# EAGLE design PoE_MotorDriver-REVA (EAGLE 8.4.2)
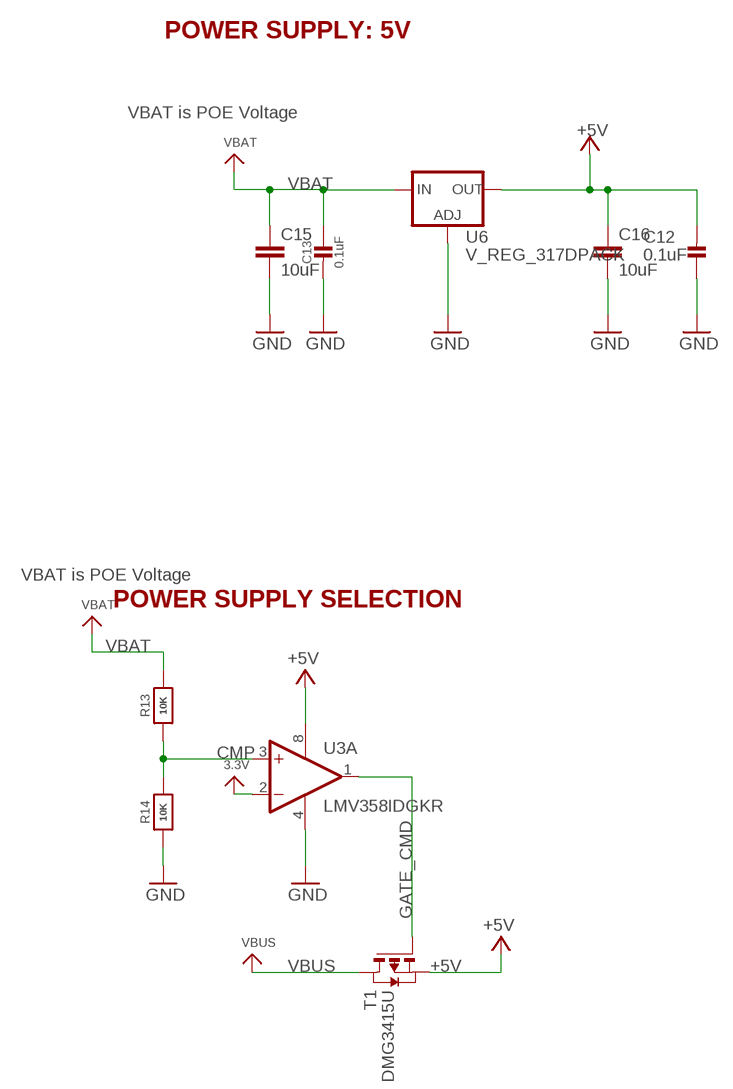
[diagram p0: schematic, sheet 1, part 1 of 2]
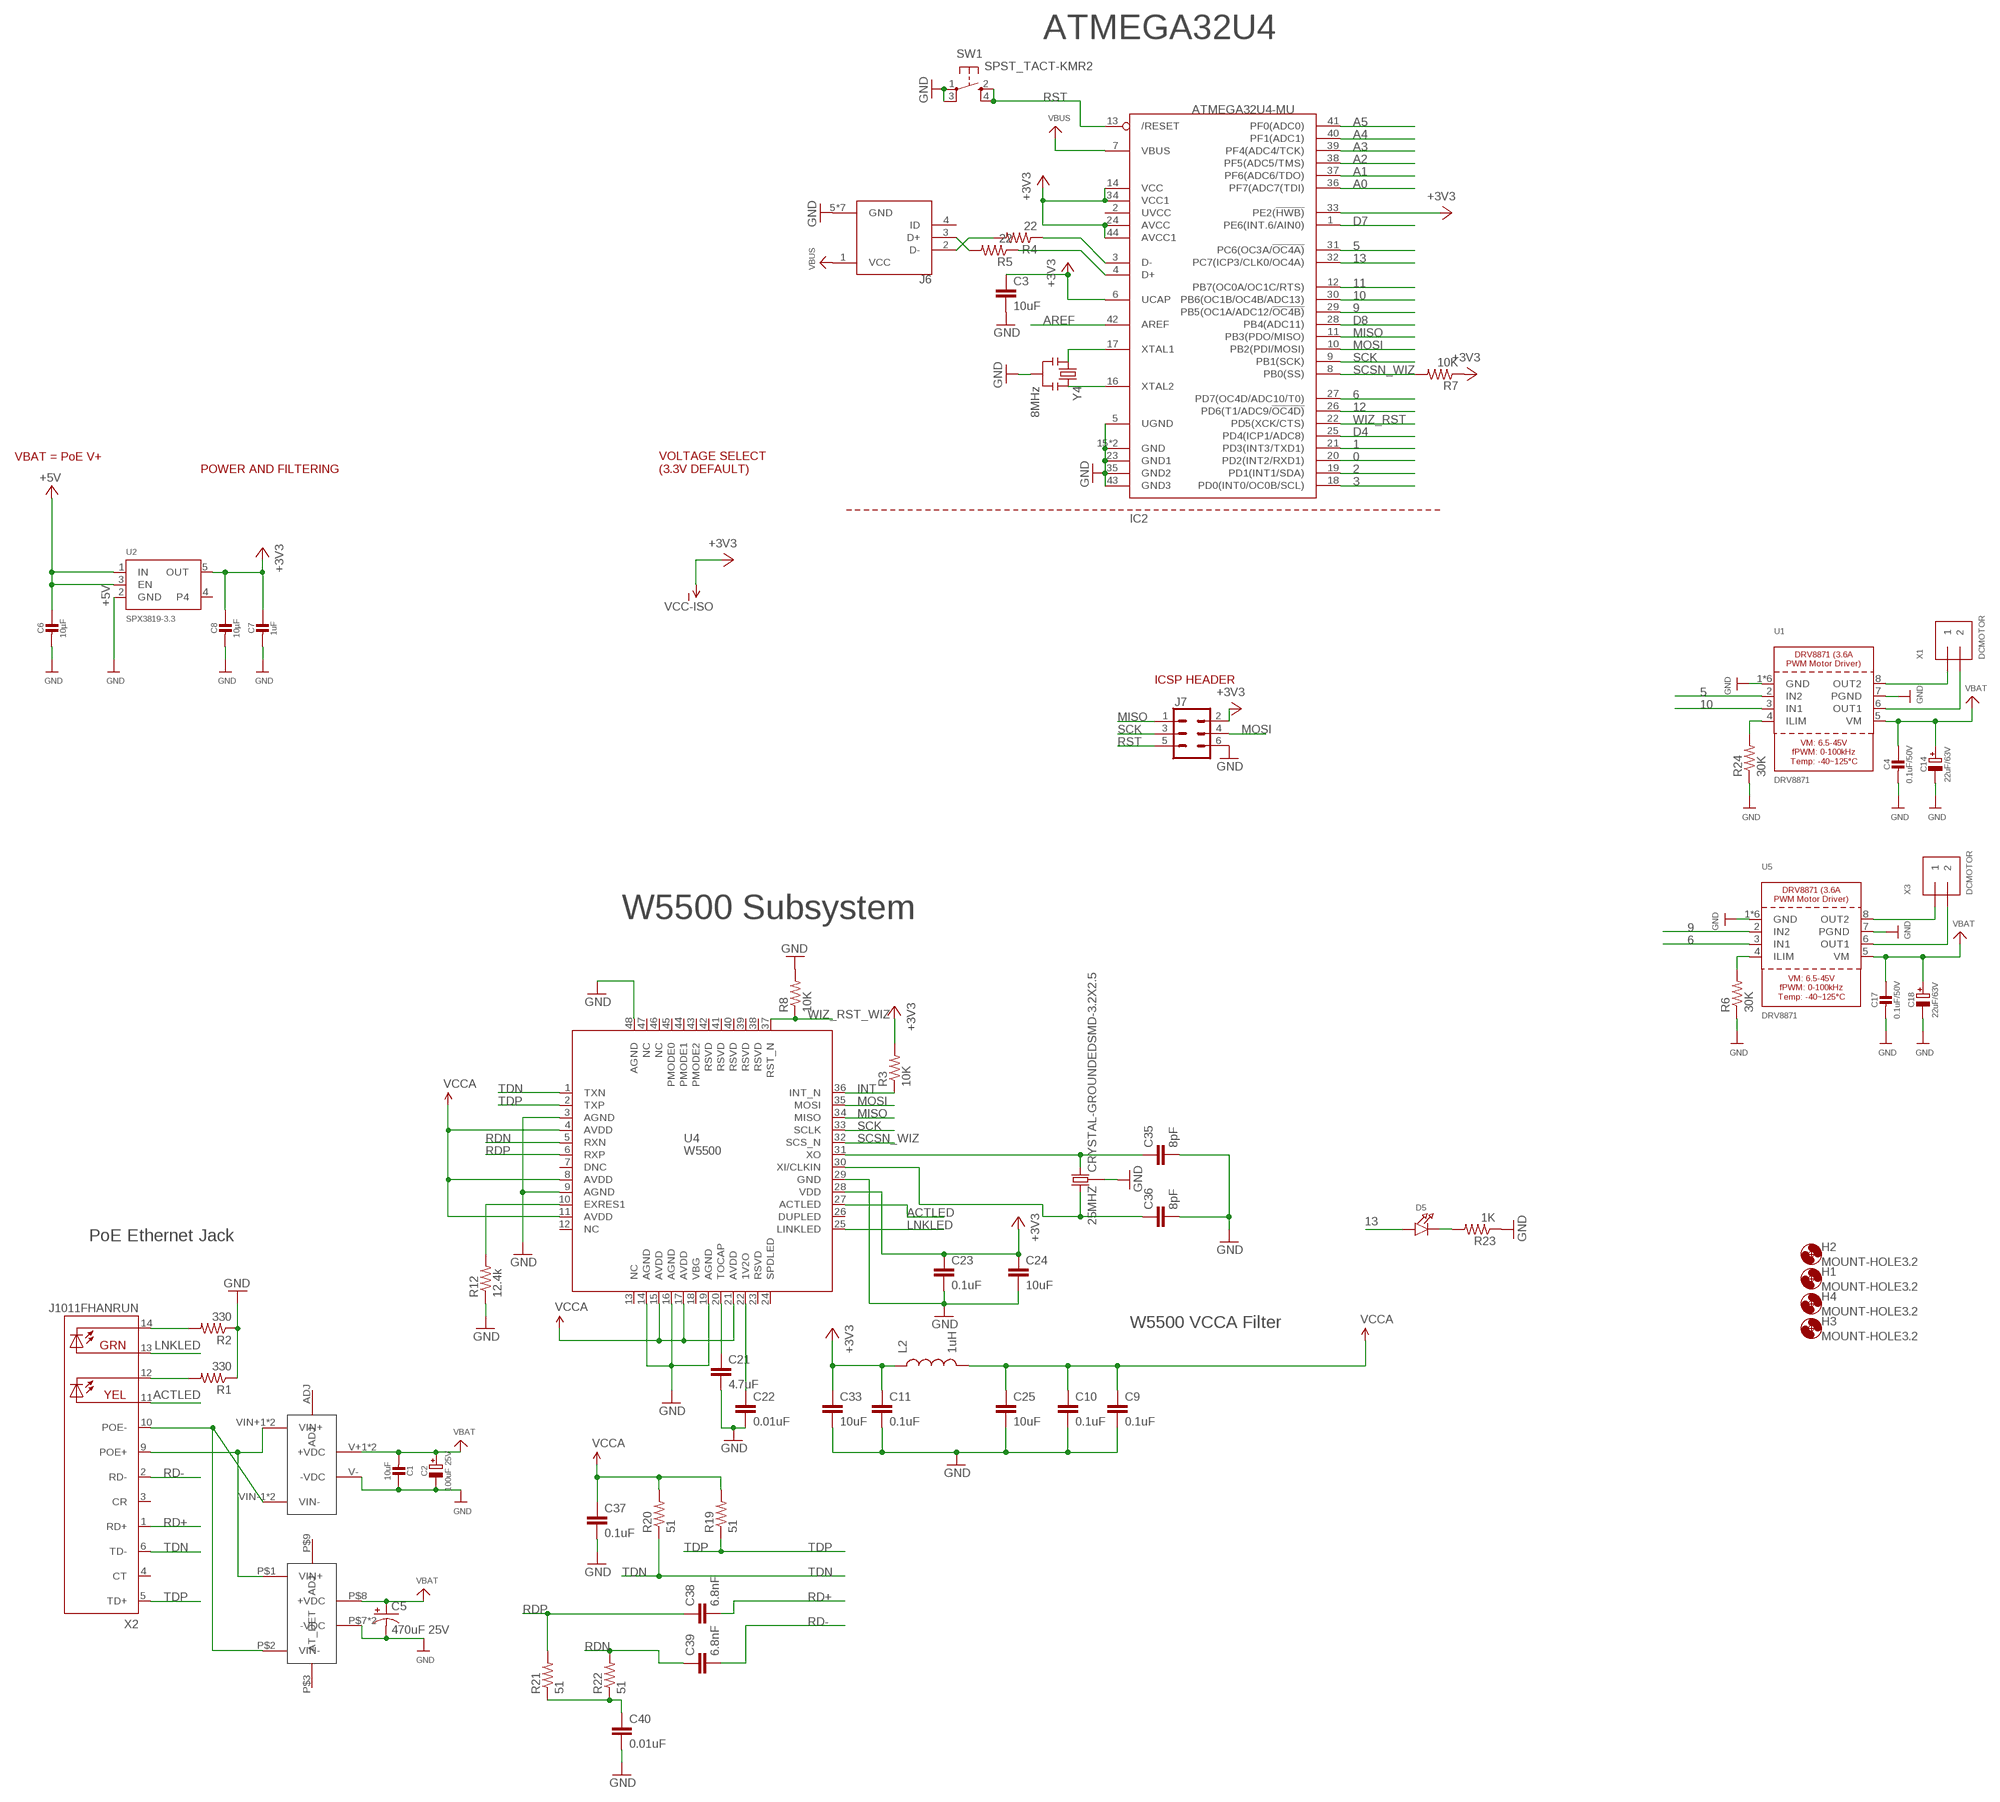
[diagram p1: schematic, sheet 1, part 2 of 2]

## Parts
25MHZ  CRYSTAL-GROUNDEDSMD-3.2X2.5  [CRYSTAL-SMD-3.2X2.5MM]
C1  10uF  CAP_CERAMIC_0805MP  [_0805MP]
C2  100uF 25V  CAP_ELECTROLYTICPANASONIC_D  [PANASONIC_D]
C3  10uF  CAP0603-CAP  [0603-CAP]
C4  0.1uF/50V  CAP_CERAMIC0603_NO  [0603-NO]
C5  470uF 25V  CAP_POLG  [PANASONIC_G]
C6  10µF  CAP_CERAMIC0603MINI  [0603-MINI]
C7  1uF  CAP_CERAMIC0603MINI  [0603-MINI]
C8  10µF  CAP_CERAMIC0603MINI  [0603-MINI]
C9  0.1uF  CAP0603-CAP  [0603-CAP]
C10  0.1uF  CAP0603-CAP  [0603-CAP]
C11  0.1uF  CAP0603-CAP  [0603-CAP]
C12  0.1uF  CAP_CERAMIC0603_NO  [0603-NO]
C13  0.1uF  CAP_CERAMIC0603_NO  [0603-NO]
C14  22uF/63V  CAP_ELECTROLYTICPANASONIC_D  [PANASONIC_D]
C15  10uF  CAP0603-CAP  [0603-CAP]
C16  10uF  CAP0603-CAP  [0603-CAP]
C17  0.1uF/50V  CAP_CERAMIC0603_NO  [0603-NO]
C18  22uF/63V  CAP_ELECTROLYTICPANASONIC_D  [PANASONIC_D]
C21  4.7uF  CAP0603-CAP  [0603-CAP]
C22  0.01uF  CAP0603-CAP  [0603-CAP]
C23  0.1uF  CAP0603-CAP  [0603-CAP]
C24  10uF  CAP0603-CAP  [0603-CAP]
C25  10uF  CAP0603-CAP  [0603-CAP]
C33  10uF  CAP0603-CAP  [0603-CAP]
C35  8pF  CAP0603-CAP  [0603-CAP]
C36  8pF  CAP0603-CAP  [0603-CAP]
C37  0.1uF  CAP0603-CAP  [0603-CAP]
C38  6.8nF  CAP0603-CAP  [0603-CAP]
C39  6.8nF  CAP0603-CAP  [0603-CAP]
C40  0.01uF  CAP0603-CAP  [0603-CAP]
D5  LED0805_NOOUTLINE  [CHIPLED_0805_NOOUTLINE]
H1  MOUNT-HOLE3.2  [3,2]
H2  MOUNT-HOLE3.2  [3,2]
H3  MOUNT-HOLE3.2  [3,2]
H4  MOUNT-HOLE3.2  [3,2]
IC2  ATMEGA32U4-MU  [TQFN44_7MM]
J6  10103594-0001LF  [FCI_10103594-0001LF]
J7  CONN_03X2NO_SILK  [2X3-NS]
L2  1uH  INDUCTOR0603  [0603]
R1  330  RESISTOR0603-RES  [0603-RES]
R2  330  RESISTOR0603-RES  [0603-RES]
R3  10K  RESISTOR0603-RES  [0603-RES]
R4  22  RESISTOR0603-RES  [0603-RES]
R5  22  RESISTOR0603-RES  [0603-RES]
R6  30K  FLIPFLOP-RES  [0805-THM]
R7  10K  RESISTOR0603-RES  [0603-RES]
R8  10K  RESISTOR0603-RES  [0603-RES]
R12  12.4k  RESISTOR0603-RES  [0603-RES]
R13  10K  RESISTOR_0603_NOOUT  [0603-NO]
R14  10K  RESISTOR_0603_NOOUT  [0603-NO]
R19  51  RESISTOR0603-RES  [0603-RES]
R20  51  RESISTOR0603-RES  [0603-RES]
R21  51  RESISTOR0603-RES  [0603-RES]
R22  51  RESISTOR0603-RES  [0603-RES]
R23  1K  RESISTOR0603-RES  [0603-RES]
R24  30K  FLIPFLOP-RES  [0805-THM]
SW1  SPST_TACT-KMR2  [KMR2]
T1  DMG3415U  PMOSSOT23  [SOT-23]
U1  DRV8871  [HSOP8]
U2  SPX3819-3.3  VREG_SOT23-5  [SOT23-5]
U3  LMV358IDGKR  LMV358MMX  [MSOP08]
U4  W5500  [W5500]
U5  DRV8871  [HSOP8]
U6  V_REG_317DPACK  [V-REG_DPACK]
U$1  SILVERTEL_POEMICRO  [AG9900]
U$16  AG5200AG5300  [AG5300]
X1  DCMOTOR  TERMBLOCK_1X2  [TERMBLOCK_1X2-3.5MM]
X2  J1011FHANRUN  [HANRUN_POE]
X3  DCMOTOR  TERMBLOCK_1X2  [TERMBLOCK_1X2-3.5MM]
Y4  8MHz  RESONATORSMD  [RESONATOR-SMD]

## Nets
0: IC2.20(PD2(INT2/RXD1))
1: IC2.21(PD3(INT3/TXD1))
2: IC2.19(PD1(INT1/SDA))
3: IC2.18(PD0(INT0/OC0B/SCL))
5: IC2.31(PC6(OC3A/!OC4A)) U1.2(IN2)
6: IC2.27(PD7(OC4D/ADC10/T0)) U5.3(IN1)
9: IC2.29(PB5(OC1A/ADC12/!OC4B)) U5.2(IN2)
10: IC2.30(PB6(OC1B/OC4B/ADC13)) U1.3(IN1)
11: IC2.12(PB7(OC0A/OC1C/RTS))
12: IC2.26(PD6(T1/ADC9/!OC4D))
13: D5.A IC2.32(PC7(ICP3/CLK0/OC4A))
+3V3: C3.1 C7.1 C8.1 C11.1 C23.1 C24.1 C33.1 IC2.6(UCAP) IC2.14(VCC) IC2.24(AVCC) IC2.33(PE2(!HWB)) IC2.34(VCC1) IC2.44(AVCC1) J7.2 L2.1 R3.2 R7.1 U2.5(OUT) U3.2(A:-IN) U4.28(VDD) ; supply symbol labelled VCC-ISO, 3.3V
+5V [usbvcc]: C6.1 C12.2 C16.1 T1.2(S) U2.1(IN) U2.3(EN) U3.8(P:V+) U6.4(OUT)
A0: IC2.36(PF7(ADC7(TDI))
A1: IC2.37(PF6(ADC6/TDO))
A2: IC2.38(PF5(ADC5/TMS))
A3: IC2.39(PF4(ADC4/TCK))
A4: IC2.40(PF1(ADC1))
A5: IC2.41(PF0(ADC0))
ACTLED: U4.27(ACTLED) X2.11(YEL-A)
AREF: IC2.42(AREF)
CMP: R13.1 R14.2 U3.3(A:+IN)
D4: IC2.25(PD4(ICP1/ADC8))
D7: IC2.1(PE6(INT.6/AIN0))
D8: IC2.28(PB4(ADC11))
D+: IC2.4(D+) R5.1
D-: IC2.3(D-) R4.1
GATE_CMD: T1.3(G) U3.1(A:OUT)
GND: 25MHZ.2 25MHZ.4 C1.1 C2.- C3.2 C4.2 C5.- C6.2 C7.2 C8.2 C9.2 C10.2 C11.2 C12.1 C13.2 C14.- C15.2 C16.2 C17.2 C18.- C21.2 C22.2 C23.2 C24.2 C25.2 C33.2 C35.2 C36.2 C37.2 C40.2 IC2.5(UGND) IC2.15(GND) IC2.23(GND1) IC2.35(GND2) IC2.43(GND3) IC2.THERMAL(GND) J6.5(GND) J6.P1(GND) J6.P2(GND) J6.P3(GND) J6.P4(GND) J6.P5(GND) J6.P6(GND) J7.6 R1.1 R2.1 R6.1 R8.2 R12.1 R14.1 R23.1 R24.1 SW1.1(P) SW1.3(P1) U1.1(GND) U1.7(PGND) U1.GND U1.P$1(GND) U1.P$2(GND) U1.P$3(GND) U1.P$4(GND) U2.2(GND) U3.4(P:V-) U4.3(AGND) U4.9(AGND) U4.14(AGND) U4.16(AGND) U4.19(AGND) U4.29(GND) U4.48(AGND) U5.1(GND) U5.7(PGND) U5.GND U5.P$1(GND) U5.P$2(GND) U5.P$3(GND) U5.P$4(GND) U6.1(ADJ) U$1.V-(-VDC) U$16.P$7(-VDC) U$16.P$10(-VDC) Y4.2
INT: R3.1 U4.36(INT_N)
LNKLED: U4.25(LINKLED) X2.13(GRN-A)
MISO: IC2.11(PB3(PDO/MISO)) J7.1 U4.34(MISO)
MOSI: IC2.10(PB2(PDI/MOSI)) J7.4 U4.35(MOSI)
N$1: U$1.VIN-1(VIN-) U$1.VIN-2(VIN-) U$16.P$2(VIN-) X2.10(POE-)
N$2: U$1.VIN+1(VIN+) U$1.VIN+2(VIN+) U$16.P$1(VIN+) X2.9(POE+)
N$3: R2.2 X2.14(GRN-C)
N$4: R1.2 X2.12(YEL-C)
N$5: R6.2 U5.4(ILIM)
N$6: J6.3(D+) R5.2
N$10: D5.C R23.2
N$11: IC2.16(XTAL2) Y4.3
N$12: IC2.17(XTAL1) Y4.1
N$13: J6.2(D-) R4.2
N$14: R24.2 U1.4(ILIM)
N$18: C21.1 U4.20(TOCAP)
N$19: C22.1 U4.22(1V2O)
N$20: R12.2 U4.10(EXRES1)
N$23: C40.1 R21.1 R22.1
N$25: 25MHZ.3 C35.1 U4.31(XO)
N$26: 25MHZ.1 C36.1 U4.30(XI/CLKIN)
OUT1: U1.6(OUT1) X1.2
OUT2: U1.8(OUT2) X1.1
OUT3: U5.8(OUT2) X3.1
OUT4: U5.6(OUT1) X3.2
RD+: C38.2 X2.1(RD+)
RD-: C39.2 X2.2(RD-)
RDN: C39.1 R22.2 U4.5(RXN)
RDP: C38.1 R21.2 U4.6(RXP)
RST: IC2.13(/RESET) J7.5 SW1.2(S) SW1.4(S1)
SCK: IC2.9(PB1(SCK)) J7.3 U4.33(SCLK)
SCSN_WIZ: IC2.8(PB0(SS)) R7.2 U4.32(SCS_N)
TDN: R20.1 U4.1(TXN) X2.6(TD-)
TDP: R19.1 U4.2(TXP) X2.5(TD+)
VBAT: C1.2 C2.+ C4.1 C5.+ C13.1 C14.+ C15.1 C17.1 C18.+ R13.2 U1.5(VM) U5.5(VM) U6.3(IN) U$1.V+1(+VDC) U$1.V+2(+VDC) U$16.P$8(+VDC)
VBUS: IC2.7(VBUS) J6.1(VCC) T1.1(D)
VCCA: C9.1 C10.1 C25.1 C37.1 L2.2 R19.2 R20.2 U4.4(AVDD) U4.8(AVDD) U4.11(AVDD) U4.15(AVDD) U4.17(AVDD) U4.21(AVDD)
WIZ_RST: IC2.22(PD5(XCK/CTS))
WIZ_RST_WIZ: R8.1 U4.37(RST_N)
Unconnected: IC2.2(UVCC) J6.4(ID) U2.4 U3.5(B:+IN) U3.6(B:-IN) U3.7(B:OUT) U4.7(DNC) U4.12(NC) U4.13(NC) U4.18(VBG) U4.23(RSVD) U4.24(SPDLED) U4.26(DUPLED) U4.38(RSVD) U4.39(RSVD) U4.40(RSVD) U4.41(RSVD) U4.42(RSVD) U4.43(PMODE2) U4.44(PMODE1) U4.45(PMODE0) U4.46(NC) U4.47(NC) U$1.ADJ U$16.P$3(AT_DET) U$16.P$9(ADJ) X2.3(CR) X2.4(CT)

## Notes on the sheet
- ATMEGA32U4
- POWER SUPPLY: 5V
- VBAT is POE Voltage
- VBAT = PoE V+
- POWER AND FILTERING
- VOLTAGE SELECT
  (3.3V DEFAULT)
- VBAT is POE Voltage
- POWER SUPPLY SELECTION
- ICSP HEADER
- W5500 Subsystem
- PoE Ethernet Jack
- W5500 VCCA Filter

## Library data of the parts
25MHZ = SparkFun-Clocks:CRYSTAL-GROUNDED: Crystals w/ Ground Pin (Generic) These are passive quartz crystals, which can be used as a clock source for a microcontroller. Crystal's are usually two-terminal devices. A third terminal may be optionally connected to ground, as recommended by the manufaturer.
C1 C4 C6-C8 C12 C13 C17 = microbuilder:CAP_CERAMIC: Ceramic Capacitors For new designs, use the packages preceded by an '_' character since they are more reliable: The following footprints should be used on most boards: _0402 - Standard footprint for regular board layouts _0603 - Standard footprint for regular board layouts _0805 - Standard footprint for regular board layouts _1206 - Standard footprint for regular board layouts For extremely tight-pitch boards where space is at a premium, the following 'micro-pitch' footprints can be used (smaller pads, no silkscreen outline, etc.): _0402MP - Micro-pitch footprint for very dense/compact boards _0603MP - Micro-pitch footprint for very dense/compact boards _0805MP - Micro-pitch footprint for very dense/compact boards _1206MP - Micro-pitch footprint for very dense/compact boards
C2 C14 C18 = microbuilder:CAP_ELECTROLYTIC: Electrolytic Capacitors SMT PANASONIC_C - Size C Panasonic Electrolytic Aluminum Capacitor 47µF 16V 20% Electrolytic Capacitor [Digikey: PCE3890TR-ND] PANASONIC_D - Size D Panasonic Electrolytic Aluminum Capacitor 100µF 25V 20% Electrolytic Capacitor [Digikey: PCE3898TR-ND] PTH 3.5 mm grid, 8 mm diameter ... 3.5 mm grid, 10 mm diameter ...
C3 C9-C11 C15 C16 C21-C25 C33 C35-C40 = SparkFun-Passives:CAP: Capacitor Standard 0603 ceramic capacitor, and 0.1" leaded capacitor.
C5 = SparkFun-Passives:CAP_POL: Capacitor Polarized These are standard SMD and PTH capacitors. Normally 10uF, 47uF, and 100uF in electrolytic and tantalum varieties. Always verify the external diameter of the through hole cap, it varies with capacity, voltage, and manufacturer. The EIA devices should be standard.
D5 = microbuilder:LED: LED 0603 - 0603 Surface Mount Package 2mA: Green LED - Low Power (3.9mcd, 2ma, 1.7Vf) - Digikey: 475-2709-2-ND Orange LED - Low Power (9.8mcd, 2ma, 1.8Vf) - Digikey: 475-1194-2-ND Red LED - Low Power (5mcd, 2ma, 1.8Vf) - Digikey: 475-1195-2-ND Yellow LED - Low Power (7mcd, 2ma, 1.8Vf) - Digikey: 475-1196-2-ND 5mA: Blue LED - Low Power (17mcd, 5ma, 2.9Vf) - Digikey: LNJ937W8CRACT-ND 0805 - 0805 Surface Mount Package 2mA: Red LED (8.8mcd, 2mA, 1.8Vf, Clear) - Low Power [Digikey: 475-2510-1-ND] Green LED (5mcd, 2mA, 1.8Vf, Clear) - Low Power [Digikey: 475-2730-1-ND] Yellow LED (11.3mcd, 2mA, 1.8Vf, Clear) - Low Power [Digikey: 475-2555-1-ND] 20mA: Red LED (104mcd, 20mA, Diffused) - LS R976 [Digikey: 475-1278-6-ND] Red LED (12mcd, 20mA, 2.0Vf, Clear) - APT2012EC [Digikey: 754-1128-1-ND] Green LED (15mcd, 20mA, 2.2Vf, Clear) - APT2012GC [Digikey: 754-1131-1-ND] Orange LED (160mcd, 20mA, 2.1Vf, Clear) - APT2012SECK [Digikey: 754-1130-1-ND] 1206 - 1206 Surface Mount Package Green LED (26mcd, 20mA, Diffused) - LG N971 [Digikey: 475-1407-6-ND] Red LED (15mcd, 20mA, Diffused) - LH N974 [Digikey: 475-1416-6-ND] Cree - Cree High-Power Surface Mount LEDs XPEBWT-L1-0000-00D50 - White 111lm 350mA 2.9Vf 6200K 110° XTEAWT-00-0000-00000LEE3 - White 114lm 350mA 2.85Vf 5000K 115° Everlight - Everlight 45-21 Series Surface Mount LEDs 45-21/QK2C-B2832AC2CB2/2T - Warm White 2000mcd 20mA 3.25Vf 3050K 120° 45-21/LK2C-B38452C4CB2/2T - Nuetral White 2000mcd 20mA 3.25Vf 4150K 120° 45-21/LK2C-B50634C6CB2/2T - Cold White 2200mcd 20mA 3.25Vf 5650K 120° PLCC2 Reverse Mount LS T77K-J1L2-1-0-2-R18-Z - Red 11.25mcd 2mA 1.8Vf 630nm 120° LO T77K-L1M2-24-Z - Orange 19.6mcd 2mA 1.8Vf 606nm 120° LY T77K-K2M1-26-Z - Yellow 15.7mcd 2mA 1.8Vf 587nm 120°
H1-H4 = holes:MOUNT-HOLE: MOUNTING HOLE with drill center marker
IC2 = microbuilder:ATMEGA32U4: http://www.ladyada.net/library/eagle
J6 = 10103594-0001LF:10103594-0001LF: Conn Micro USB Type B RCP 5 POS 0.65mm Solder RA SMD 5 Terminal 1 Port T/R; AVAILABILITY: Good; DESCRIPTION: Conn Micro USB Type B RCP 5 POS 0.65mm Solder RA SMD 5 Terminal 1 Port T/R; MF: FCI; MP: 10103594-0001LF; PACKAGE: None; PRICE: 0.40 USD
J7 = SparkFun-Connectors:CONN_03X2: Multi connection point. Often used as Generic Header-pin footprint for 0.1 inch spaced/style header connections You can populate with any combo of single row headers, but if you'd like an exact match, check these: Header - 2x3 (Male, 0.1") <https://www.sparkfun.com/products/12807> (PRT-12807) Header - 2x3 (Female, 0.1") <https://www.sparkfun.com/products/13010> (PRT-13010) 2x3 Pin Shrouded Header <https://www.sparkfun.com/products/10877> (PRT-10877) On any of the 0.1 inch spaced packages, you can populate with these: Break Away Headers - Straight <https://www.sparkfun.com/products/116> (PRT-00116) Break Away Male Headers - Right Angle <https://www.sparkfun.com/products/553> (PRT-00553) Female Headers <https://www.sparkfun.com/products/115> (PRT-00115) Break Away Headers - Machine Pin <https://www.sparkfun.com/products/117> (PRT-00117) Break Away Female Headers - Swiss Machine Pin <https://www.sparkfun.com/products/743> (PRT-00743) Special note: the shrouded connector mates well with our 3x2 ribbon cables: Ribbon Crimp Connector - 6-pin (2x3, Female) <https://www.sparkfun.com/products/10651> (PRT-10651) Ribbon Cable - 6 wire (15ft) <https://www.sparkfun.com/products/10646> (PRT-10646)
L2 = SparkFun-Passives:INDUCTOR: Inductors Basic Inductor/Choke - 0603 and 1206. Footprints are not proven and vary greatly between part numbers. INDUCTOR POWER 3.3UH 4.0A SMD 0.197" L x 0.197" W x 0.177" H (5.00mm x 5.00mm x 4.50mm)
R1-R5 R7 R8 R12 R19-R23 = SparkFun-Passives:RESISTOR: Resistor Basic schematic elements and footprints for 0603, 1206, and PTH resistors.
R6 R24 = adafruit:FLIPFLOP-RES: Flip Flop resistor An 0805 resistor inside a standard 1/4W 5% resistor. Makes for easy mods
R13 R14 = microbuilder:RESISTOR: Resistors For new designs, use the packages preceded by an '_' character since they are more reliable: The following footprints should be used on most boards: _0402 - Standard footprint for regular board layouts _0603 - Standard footprint for regular board layouts _0805 - Standard footprint for regular board layouts _1206 - Standard footprint for regular board layouts For extremely tight-pitch boards where space is at a premium, the following 'micro-pitch' footprints can be used (smaller pads, no silkscreen outline, etc.): _0402MP - Micro-pitch footprint for very dense/compact boards _0603MP - Micro-pitch footprint for very dense/compact boards _0805MP - Micro-pitch footprint for very dense/compact boards _1206MP - Micro-pitch footprint for very dense/compact boards
SW1 = adafruit:SPST_TACT: SMT 6mm switch, EVQQ2 series http://www.ladyada.net/library/eagle
T1 = zetex:PMOSSOT23: MOS FET; OC_FARNELL: unknown; OC_NEWARK: unknown
U1 U5 = microbuilder:DRV8871: DRV8871 - 3.6A PWM Motor Driver
U2 = microbuilder:VREG_SOT23-5: SOT23-5 Fixed Voltage Regulators Part Current Out V Out V In V Dropout θJA (°C/W) TJ (°C) Digikey Part No. ADP121 150mA 3.3V 3.4-5.5V 0.09V @ 150mA -- -- ADP121-AUJZ33R7CT-ND ADP121 150mA 3.0V 3.1-5.5V 0.09V @ 150mA -- -- ADP121-AUJZ30R7CT-ND ADP122 300mA 3.3V 3.4-5.5V 0.085V @ 300mA -- -- ADP122AUJZ-3.3-R7CT-ND ADP1712 300mA 3.3V 3.5-5.5V 0.17V @ 300mA -- -- ADP1712AUJZ-3.3-R7TR-ND AP7311 (Low Cost) 150mA 3.3V 3.5-6V 0.15V @ 150mA -- -- AP7311-33WG-7DICT-ND LD39015M18R 150mA 1.8V 1.9V-5.5V 0.08V @ 100mA -- -- 497-6977-1-ND LP2985A-33DBVR 150mA 3.3V 3.3-16V 0.28V @ 150mA 206 150 296-18479-1-ND MCP1824T-3302E/OT 300mA 3.3V 3.5V-6V 0.2V @ 300mA -- -- MCP1824T-3302E/OTCT-ND MIC5205-2.5YM5 TR 150mA 2.5V 2.7-16V 0.165V @ 150mA -- -- 576-1257-2-ND MIC5205-3.0YM5 TR 150mA 3.0V 3.2V-16V 0.165V @ 150mA -- -- 576-1258-2-ND MIC5205-3.3YM5 TR 150mA 3.3V 3.5V-16V 0.165V @ 150mA -- -- 576-1259-2-ND TPS780330220 150mA 3.3V+2.2V 3.6-5.5V 250mV Max -- -- 296-23332-1-ND TDA3663/N1,135 100mA 3.3V 3.5-45V 0.18V @ 50mA -- -- 568-5343-1-ND Max operating temp can be calculated using θJA, TJ (max junction temperature), and power in watts. Set the "Maximum Ambient Temperature" until it reaches TJ ("Max Junction Temperature"), which is the absolute limit for safe use of the regulator: Heat Sink Temperature Calculator <http://www.daycounter.com/Calculators/Heat-Sink-Temperature-Calculator.phtml> For example, With 12V source into a 3.3V LP2985 and a 30mA load, we are dissipating (12V-3.3V) * 0.03A = 0.261W. With a θJA of 206 °C/W, a TJ of 150°C, and 261mW we can safely use the chip without a heat sink up to 75°C (=147.1°C Junction Temperature).
U3 = linear:LMV358?*: Dual General Purpose, Low Voltage, Rail-to-Rail Output Operational Amplifiers Source: http://www.national.com/mpf/LM/LMV321.html http://www.national.com/dt/lmv_qual.pdf
U4 = W5500:W5500
U6 = SparkFun-IC-Power:V_REG_317: Voltage Regulator Standard LM317 adjustable voltage regulator. AOI (Adjust Output Input). Google 'LM317 Calculator' for easy to use app to get the two resistor values needed. 240/720 for 5V output. 240/390 for 3.3V output. Spark Fun Electronics SKU : COM-00527; PROD_ID: IC-09888
U$1 = Heep:SILVERTEL_POE
U$16 = Heep:AG5200
X1 X3 = microbuilder:TERMBLOCK_1X2: 3.5mm Terminal block http://www.ladyada.net/library/pcb/eaglelibrary.html
X2 = Heep:J1011F: PULSEJACK (TM) 1x1 Tab-UP RJ45 10/100 Base-TX RJ45 1x1 Tab-UP with LEDs 8-pin (J1 series) and 6-pin (JP series) integrated magnetics connector, designed to support applications, such as ADSL modems, LAN-on-Motherboard, and Hub and Switches. Source: www.pulseeng.com .. PulseJack-J402.pdf
Y4 = SparkFun:RESONATOR: Resonator Small SMD resonator. This is the itty bitty 10/20MHz resonators with built in caps. CSTCE10M0G55 and CSTCE20M0V53. Footprint has been reviewed closely but hasn't been tested yet.

## Net classes
3 usbvcc: width 0.305 mm, drill 0.483 mm, clearance 0.203 mm

## Board
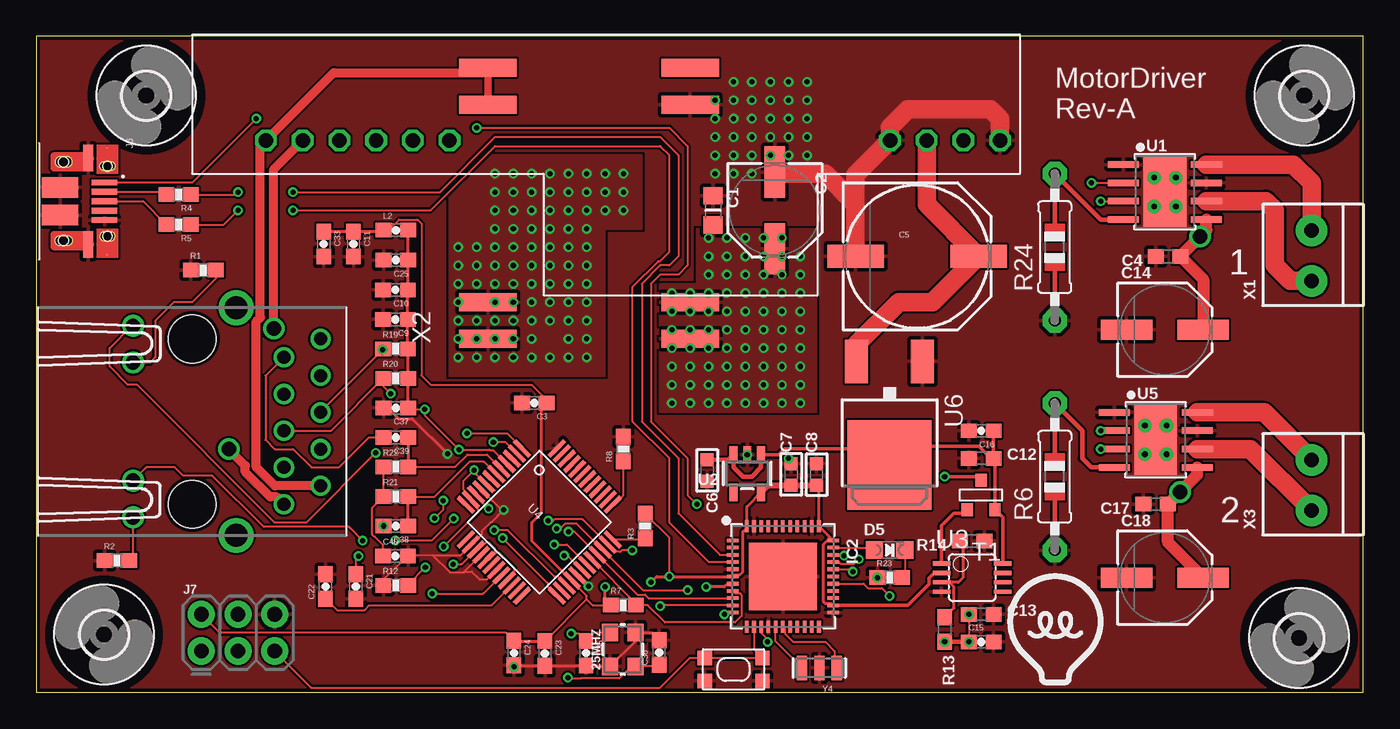
[diagram p2: board, top side]
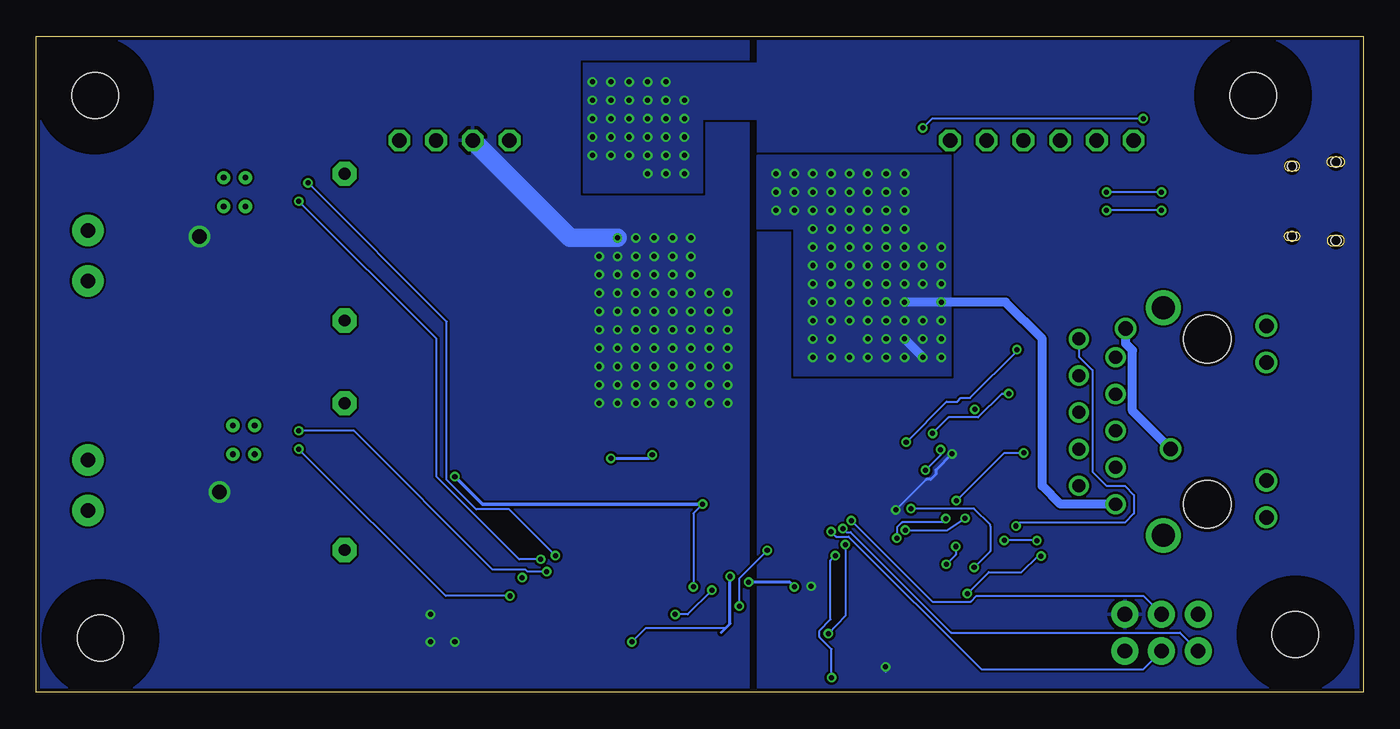
[diagram p3: board, bottom side, seen from below]

Size 91.84 x 45.39 mm. Coordinates in mm from the lower left corner, seen from the top.
Outline: 0,0 91.84,0 91.84,45.39 0,45.39 0,0
Copper layers (1*16): Top 0.035mm / dielectric 1.5mm / Bottom 0.035mm
Design rules "SeeedStudio_2layer_DRU_no_angle_20140221": minimum track width 6mil, minimum drill 12mil, track to track 6mil, track to pad 6mil, pad to pad 6mil, via to via 6mil, smd to smd 0mil, copper to edge 10mil, drill to drill 10mil, minimum pad ring 10mil, minimum via ring 6mil, stop-mask expansion 2mil, vias tented up to drill 100mil, thermal gap 10mil

### Footprints (pad centres in the part's own frame; a part is rotated, then mirrored left to right if it is on the bottom)
CRYSTAL-SMD-3.2X2.5MM = smd 1.2 x 1.1: 1 -1.175,-0.875; 2 1.175,-0.875; 3 1.175,0.875; 4 -1.175,0.875
_0805MP = smd 1.2 x 1.3: 1 -1.016,0; 2 1.016,0
PANASONIC_D = smd 3.556 x 1.4: + 2.654,0; - -2.654,0
0603-CAP = smd 1.1 x 1: 1 -0.85,0; 2 0.85,0
0603-NO = smd 1.1 x 1: 1 -0.85,0; 2 0.85,0
PANASONIC_G = smd 3.9 x 1.6: + 4.25,0; - -4.25,0
0603-MINI = smd 0.9 x 0.9: 1 -0.75,0; 2 0.75,0
CHIPLED_0805_NOOUTLINE = smd 1.2 x 1.2: A 0,-1.05; C 0,1.05
3,2 = hole 3.2: 0,0
TQFN44_7MM = smd 0.25 x 0.8: 1 -2.5,-3.475; 2 -2,-3.475; 3 -1.5,-3.475; 4 -1,-3.475; 5 -0.5,-3.475; 6 0,-3.475; 7 0.5,-3.475; 8 1,-3.475; 9 1.5,-3.475; 10 2,-3.475; 11 2.5,-3.475; 23 2.5,3.475; 24 2,3.475; 25 1.5,3.475; 26 1,3.475; 27 0.5,3.475; 28 0,3.475; 29 -0.5,3.475; 30 -1,3.475; 31 -1.5,3.475; 32 -2,3.475; 33 -2.5,3.475 | smd 0.8 x 0.25: 12 3.475,-2.5; 13 3.475,-2; 14 3.475,-1.5; 15 3.475,-1; 16 3.475,-0.5; 17 3.475,0; 18 3.475,0.5; 19 3.475,1; 20 3.475,1.5; 21 3.475,2; 22 3.475,2.5; 34 -3.475,2.5; 35 -3.475,2; 36 -3.475,1.5; 37 -3.475,1; 38 -3.475,0.5; 39 -3.475,0; 40 -3.475,-0.5; 41 -3.475,-1; 42 -3.475,-1.5; 43 -3.475,-2; 44 -3.475,-2.5 | smd 4.7 x 4.7: THERMAL 0,0
FCI_10103594-0001LF = smd 0.4 x 1.75: 1 -1.3,2.825; 2 -0.65,2.825; 3 0,2.825; 4 0.65,2.825; 5 1.3,2.825 | smd 0.1 x 0.1: P1 -3.7,3; P2 3.7,3 | smd 1.825 x 0.7: P3 -2.987,1.7; P4 2.987,1.7 | smd 1.425 x 2.5: P5 -0.963,-0.25; P6 0.963,-0.25 | hole 0.7: -2.725,0; 2.725,0 | hole 0.65: -2.425,3.03; 2.425,3.03
2X3-NS = drill 1.016 pad 1.88: 1 -2.54,-1.27; 2 -2.54,1.27; 3 0,-1.27; 4 0,1.27; 5 2.54,-1.27; 6 2.54,1.27
0603 = smd 1.1 x 1: 1 -0.85,0; 2 0.85,0
0603-RES = smd 1.1 x 1: 1 -0.85,0; 2 0.85,0
0805-THM = drill 0.813 pad 1.676 octagon: 1 -5.08,0; 2 5.08,0
KMR2 = smd 1 x 1: 1 2,0.8; 2 2,-0.8; 3 -2,0.8; 4 -2,-0.8
SOT-23 = smd 0.787 x 0.889: 1 0.025,-1.016; 2 -0.94,1.016; 3 0.991,1.016
HSOP8 = smd 0.45 x 2.15: 1 -1.905,-2.875; 2 -0.635,-2.875; 3 0.635,-2.875; 4 1.905,-2.875; 5 1.905,2.875; 6 0.635,2.875; 7 -0.635,2.875; 8 -1.905,2.875 | smd 4.9 x 2.95: GND 0,0 | drill 0.4: P$1 -1,0.75; P$2 -1,-0.75; P$3 1,-0.75; P$4 1,0.75
SOT23-5 = smd 0.55 x 1.2: 1 -0.95,-1.3; 2 0,-1.3; 3 0.95,-1.3; 4 0.95,1.3; 5 -0.95,1.3
MSOP08 = smd 0.3 x 1.2: 1 -0.976,-2.113; 2 -0.326,-2.113; 3 0.324,-2.113; 4 0.974,-2.113; 5 0.974,2.112; 6 0.324,2.112; 7 -0.326,2.112; 8 -0.976,2.112
W5500 = smd 1.5 x 0.3: 1 -4.45,2.75; 2 -4.45,2.25; 3 -4.45,1.75; 4 -4.45,1.25; 5 -4.45,0.75; 6 -4.45,0.25; 7 -4.45,-0.25; 8 -4.45,-0.75; 9 -4.45,-1.25; 10 -4.45,-1.75; 11 -4.45,-2.25; 12 -4.45,-2.75; 25 4.45,-2.75; 26 4.45,-2.25; 27 4.45,-1.75; 28 4.45,-1.25; 29 4.45,-0.75; 30 4.45,-0.25; 31 4.45,0.25; 32 4.45,0.75; 33 4.45,1.25; 34 4.45,1.75; 35 4.45,2.25; 36 4.45,2.75 | smd 0.3 x 1.5: 13 -2.75,-4.45; 14 -2.25,-4.45; 15 -1.75,-4.45; 16 -1.25,-4.45; 17 -0.75,-4.45; 18 -0.25,-4.45; 19 0.25,-4.45; 20 0.75,-4.45; 21 1.25,-4.45; 22 1.75,-4.45; 23 2.25,-4.45; 24 2.75,-4.45; 37 2.75,4.45; 38 2.25,4.45; 39 1.75,4.45; 40 1.25,4.45; 41 0.75,4.45; 42 0.25,4.45; 43 -0.25,4.45; 44 -0.75,4.45; 45 -1.25,4.45; 46 -1.75,4.45; 47 -2.25,4.45; 48 -2.75,4.45
V-REG_DPACK = smd 1.6 x 3: 1 -2.28,-4.8; 3 2.28,-4.8 | smd 5.8 x 6.2: 4 0,2.38
AG9900 = smd 1.25 x 4: ADJ 18.75,0; V+1 0,0; V+2 2.54,0; V- 16.21,0; VIN+1 18.75,14; VIN+2 16.21,14; VIN-1 2.54,14; VIN-2 0,14
AG5300 = drill 1 octagon: P$1 5.11,2.3; P$2 7.65,2.3; P$3 10.19,2.3; P$4 12.73,2.3; P$5 15.27,2.3; P$6 17.81,2.3; P$7 48.29,2.3; P$8 50.83,2.3; P$9 53.37,2.3; P$10 55.91,2.3
TERMBLOCK_1X2-3.5MM = drill 1 pad 2.184: 1 1.8,0; 2 -1.7,0
HANRUN_POE = drill 0.9 pad 1.3: 1 5.715,-8.89; 2 4.445,-6.35; 3 3.175,-8.89; 4 1.905,-6.35; 5 0.635,-8.89; 6 -0.635,-6.35; 7 -1.905,-8.89; 8 -3.175,-6.35; 9 -4.445,-8.89; 10 -5.715,-6.35 | drill 1 pad 1.422: 11 6.625,4.08; 12 4.085,4.08; 13 -4.085,4.08; 14 -6.625,4.08 | drill 1.6 pad 2.184: M1 7.875,-3.05; M2 -7.875,-3.05 | hole 3.3: -5.715,0; 5.715,0
RESONATOR-SMD = smd 0.7 x 1.7: 1 -1.2,0; 2 0,0; 3 1.2,0

### Placement (x,y rotation side)
25MHZ  40.59,2.97 90 top
C1  46.84,33.34 270 top
C2  51.11,33.34 270 top
C3  34.47,20.03 180 top
C4  78.32,30.16 180 top
C5  60.96,30.16 0 top
C6  46.43,15.35 270 top
C7  52.25,15.08 90 top
C8  54.01,15.06 90 top
C9  24.87,25.8 180 top
C10  24.87,27.85 180 top
C11  21.96,31 270 top
C12  65.41,16.19 0 top
C13  65.41,5.4 0 top
C14  78.1,25.08 0 top
C15  65.41,3.49 0 top
C16  65.41,18.1 180 top
C17  77.47,13.02 180 top
C18  78.1,7.94 0 top
C21  22.13,7.31 270 top
C22  20.03,7.32 90 top
C23  35.21,2.7 270 top
C24  33.07,2.72 270 top
C25  24.88,29.9 180 top
C33  19.9,31 270 top
C35  38.05,2.71 270 top
C36  43.11,2.76 90 top
C37  24.88,19.68 180 top
C38  24.88,11.51 180 top
C39  24.9,17.64 180 top
C40  24.87,9.44 0 top
D5  59.05,9.84 270 top
H1  87.75,41.28 0 top
H2  4.71,4 270 top
H3  7.62,41.28 0 top
H4  87.39,3.75 0 top
IC2  51.67,8.01 270 top
J6  1.91,33.97 270 top
J7  13.97,4.13 0 top
L2  24.9,31.97 0 top
R1  11.56,29.2 0 top
R2  5.59,9.12 0 top
R3  42.14,11.51 90 top
R4  9.87,34.43 180 top
R5  9.87,32.35 180 top
R6  70.48,14.92 90 top
R7  40.64,6.03 0 top
R8  40.64,16.83 90 top
R12  24.88,7.41 0 top
R13  62.87,4.34 270 top
R14  64.77,10.48 180 top
R19  24.87,23.76 0 top
R20  24.88,21.73 0 top
R21  24.89,13.55 0 top
R22  24.89,15.59 0 top
R23  59.05,7.94 0 top
R24  70.48,30.8 90 top
SW1  48.26,1.59 180 top
T1  65.41,13.65 180 top
U1  78.1,34.61 270 top
U2  49.21,15.13 180 top
U3  64.77,7.94 270 top
U4  34.82,11.78 315 top
U5  77.47,17.46 270 top
U6  59.05,18.1 180 top
U$1  45.26,24.45 90 top
U$15  [HEEPLOGOSMALL]  66.04,-0.32 0 top
U$16  10.79,35.88 0 top
X1  88.27,30.16 90 top
X2  10.79,18.73 90 top
X3  88.27,14.29 90 top
Y4  54.2,1.7 180 top

### Tracks (layer width: path | path; a pad name or v marks a point on that pad's centre or on a via)
5  (via drill 0.35)
  Top 0.152: IC2.31 55.85,9.51 v55.91,9.46 | v73.02,35.24 U1.2
  Bottom 0.152: v55.91,9.46 59.11,12.66 61.39,12.66 63.42,14.69 63.42,25.64 v73.02,35.24
6  (via drill 0.35)
  Top 0.152: v59.05,6.67 58.51,7.21 57.56,7.21 57.25,7.51 IC2.27 | v73.66,16.83 U5.3
  Bottom 0.152: v59.05,6.67 63.5,6.67 v73.66,16.83
9  (via drill 0.35)
  Top 0.152: IC2.29 56.35,8.51 v56.52,8.35 | v73.66,18.1 U5.2
  Bottom 0.152: v56.52,8.35 57.83,8.35 57.98,8.49 60.25,8.49 69.85,18.1 v73.66,18.1
10  (via drill 0.35)
  Top 0.152: IC2.30 55.56,9.01 55.68,8.9 56.62,8.9 v56.93,9.21 | v73.66,33.97 U1.3
  Bottom 0.152: v56.93,9.21 58.42,9.21 64.13,14.92 64.13,24.45 v73.66,33.97
13
  Top 0.152: IC2.32 57.83,10.01 D5.A
+3V3  (via drill 0.35)
  Top 0.152: L2.1 24.37,31.97 25.1,32.7 26.39,32.7 26.67,32.42 26.67,21.91 27.3,21.27 34.29,21.27 35.32,20.25 C3.1 | C23.1 38.1,6.44 | 38.1,6.44 38.1,6.67 37.08,7.69 U4.28 | 38.1,6.44 38.51,6.03 R7.1 | v50.62,3.49 50.62,3.68 50.16,4.13 IC2.14 | C24.1 32.51,4.13 12.7,4.13 J7.2 | v43.82,8.01 43.82,10.68 R3.2
  Top 0.2: 53.99,14.33 C8.1 | C24.1 33.08,3.55 C23.1 | L2.1 23.92,31.85 C11.1 | C11.1 | C11.1 C33.1
  Top 0.203: U2.5 49.17,12.85 IC2.44 49.17,11.39 48.9,11.11 48.9,8.33 48.7,8.14 48.32,8.14 IC2.6 v43.82,8.01 42.93,8.01 v42.55,7.63 | C8.1 54.17,14.15 IC2.34 54.89,10.77 | 54.89,10.77 IC2.33 | R7.1 39.37,6.45 v39.37,7.3 | C3.1 34.93,19.64 34.93,12.38 34.29,11.75 34.29,10.48 37.02,7.75 U4.28 | IC2.24 55.03,6.14 54.64,6.14 54.49,6.28 54.49,10.25 54.89,10.65 54.89,10.77
  Top 0.254: U3.2 62.16,8.26 61.78,7.88 61.78,7.49 60.33,6.03 55.16,6.03 IC2.24
  Top 0.406: U2.5 50.65,14.33 C7.1 52.26,14.31 C8.1
  Bottom 0.152: 44.13,4.45 49.66,4.45 v50.62,3.49
  Bottom 0.203: v39.37,7.3 39.7,7.63 v42.55,7.63 | 44.45,4.13 44.13,4.45 43.82,4.76 v43.82,8.01
+5V
  Top 0.254: U2.1 51.38,16.43 51.8,16.85 57.92,16.85 U6.4 60.36,17.02 65.24,17.02 66.07,16.19 C12.2 | C16.1 C12.2 | C12.2 66.34,16.1 T1.2 66.88,12.1 U3.8
  Top 0.305: C6.1 47.92,16.1 U2.3 48.26,15.56 48.9,14.92 49.53,14.92 50.16,15.56 U2.1
ACTLED  (via drill 0.35)
  Top 0.152: v28.17,13.26 28.17,12.64 v27.57,12.04 | U4.27 36.09,8.02 35.84,8.02 32.64,11.22 v31.7,11.22 | v23.49,16.57 18.67,11.75 16.51,11.75 6.99,21.27 6.35,21.27 5.08,22.54 5.08,23.81 6.62,25.36 X2.11
  Bottom 0.152: v31.7,11.22 28.8,11.2 v27.57,12.04 | v28.17,13.26 28.15,13.25 24.83,16.57 v23.49,16.57
CMP
  Top 0.203: R13.1 63.51,5.84 63.51,7.22 63.5,7.23 63.5,7.3 63.19,7.61 | 63.19,7.61 U3.3 | R14.2 64.13,10.26 64.13,7.94 63.81,7.61 63.19,7.61
D+  (via drill 0.35)
  Top 0.152: IC2.4 46.55,9.01 43.82,11.75 43.82,16.19 41.27,18.73 41.27,28.05 43.05,29.83 43.18,29.83 43.82,30.47 43.82,37.15 43.18,37.78 31.75,37.78 27.3,33.34 v17.78,33.34 | R5.1 12.98,32.35 v13.97,33.34
  Bottom 0.152: v13.97,33.34 v17.78,33.34
D-  (via drill 0.35)
  Top 0.152: IC2.3 47.32,9.51 44.45,12.38 44.45,16.19 41.91,18.73 41.91,28.26 43.18,29.53 43.82,29.53 44.45,30.16 44.45,37.15 43.18,38.42 31.75,38.42 27.94,34.61 v17.78,34.61 | R4.1 13.79,34.43 v13.97,34.61
  Bottom 0.152: v13.97,34.61 v17.78,34.61
GATE_CMD
  Top 0.254: U3.1 62.66,11.54 63.5,12.38 64.16,12.38 T1.3
GND  (via drill 0.35)
  Top 0.152: 24.02,7.8 C40.2 27.44,9.5 | 32.21,12.62 U4.9 | 27.44,9.5 28.64,8.31 29.58,8.31 29.63,8.36 | 27.44,9.5 29.36,9.5 U4.14 30.12,10.22 30.85,10.95 30.85,11.17 31.47,11.78 31.51,11.78 v32.35,12.62 | 37.51,8.1 U4.29 | U4.29 37.44,8.13 | 29.63,8.36 U4.16 | 29.63,8.36 30.14,8.36 30.68,7.81 31.2,7.81 U4.19 | U4.29 37.45,8.1 v38.21,7.34
  Top 0.2: 23.64,7.1 R12.1 24.02,7.8 | v28.46,16.5 26.03,18.93 25.08,18.93 24.33,19.68 C37.2 | 32.21,12.62 v32.35,12.62 | 33.07,1.42 v33.07,1.76 C24.2 33.08,1.85 C23.2 C35.2 38.11,1.8 25MHZ.4 41.46,3.55 41.46,4.1 | 41.46,4.1 25MHZ.2 | C36.2 42.62,4.1 41.46,4.1 | 4.74,8.75 R2.1
  Top 0.203: C7.2 52.25,16.02 v52.07,16.19
  Top 1.27: C5.- 56.71,33.78 | 56.71,33.78 54.61,35.88 51.22,35.88 C2.- | 56.71,33.78 56.71,35.8 U$16.P$7 59.09,39.08 60.33,40.32 66.04,40.32 66.67,39.69 66.67,38.21 U$16.P$10
  Bottom 0.152: 30.24,14.73 v32.35,12.62 | 33.07,1.42 v33.07,1.76
  Bottom 0.2: 30.24,14.73 29.93,14.73 29.59,15.07 29.59,15.37 v28.46,16.5
  Bottom 0.203: v52.07,16.19 49.45,16.19 U2.2
  other vias: 48.26,42.23 49.53,42.23 50.8,42.23 52.07,42.23 53.34,42.23 53.34,40.96 52.07,40.96 50.8,40.96 49.53,40.96 48.26,40.96 46.99,40.96 46.99,39.69 48.26,39.69 49.53,39.69 49.53,38.42 50.8,39.69 52.07,39.69 53.34,39.69 53.34,37.15 53.34,38.42 52.07,38.42 52.07,37.15 50.8,38.42 50.8,37.15 49.53,37.15 49.53,35.88 48.26,35.88 48.26,37.15 48.26,38.42 46.99,38.42 46.99,37.15 46.99,35.88 49.21,16.43 58.21,7.94
  pour Top (rank 2): -6.98,47.94 95.88,47.94 95.88,-0.95 -6.98,-0.95
  pour Bottom: 39.37,43.5 53.98,43.5 53.98,34.61 45.72,34.61 45.72,39.69 39.37,39.69
  pour Bottom (rank 2): 41.91,-0.95 -1.91,-0.95 -1.91,51.75 41.91,51.75
INT
  Top 0.152: U4.36 42.06,10.58 R3.1
LNKLED  (via drill 0.35)
  Top 0.152: 21.75,11.34 v22.59,10.5 21.65,11.44 15.75,11.44 12.19,15 10.16,15 9.6,15.56 7.62,15.56 X2.13 | v28.89,12.01 27.39,10.52 v24.85,10.52 | 36.02,6.78 U4.25 35.4,7.31 35.4,7.55 v32.29,10.67
  Bottom 0.152: v28.89,12.01 29.11,11.79 31.9,11.79 31.91,11.78 31.93,11.78 32.26,11.46 32.26,10.99 32.24,10.98 32.24,10.96 32.29,10.92 v32.29,10.67 | v22.59,10.5 22.61,10.52 v24.85,10.52
MISO  (via drill 0.35)
  Top 0.152: v45.09,7.07 42,7.07 U4.34 37.41,11.67 36.6,11.67 36.26,11.33 v36.02,11.33 | v47.62,5.4 47.74,5.51 IC2.11
  Bottom 0.152: v45.09,7.07 46.76,5.4 v47.62,5.4 | v36.02,11.33 35.77,11.08 35.49,11.08 28.54,4.13 12.7,4.13 J7.1
MOSI  (via drill 0.35)
  Top 0.152: IC2.10 43.24,6.01 v43.18,5.96 | v41.25,9.82 40.53,9.82 40.43,9.71 40.07,9.71 U4.35 37.81,11.97 35.88,11.97 35.79,11.88 v35.43,11.88
  Bottom 0.152: v43.18,5.96 43.18,7.89 v41.25,9.82 | v35.43,11.88 29.82,6.27 27.17,6.27 26.78,6.67 15.24,6.67 J7.4
N$1  (via drill 0.35, 1)
  Top 0.61: X2.10 16.64,13.53 16.19,13.53 14.48,15.24 14.48,15.68 v13.34,16.83 | v16.45,25.16 16.45,36.18 U$16.P$2
  Bottom 0.61: X2.10 20.95,13.02 22.22,14.29 22.22,24.45 24.76,26.99 v31.75,26.99 | 30.65,23.34 v31.75,24.45 | v16.45,25.16 16.45,24.12 15.98,23.66 15.98,19.48 v13.34,16.83
  other vias: 40.64,35.88 40.64,34.61 40.64,33.34 39.37,35.88 39.37,34.61 39.37,33.34 38.1,33.34 38.1,34.61 38.1,35.88 38.1,32.07 38.1,30.8 38.1,29.53 36.83,32.07 36.83,30.8 36.83,29.53 35.56,29.53 35.56,30.8 35.56,32.07 36.83,35.88 36.83,34.61 36.83,33.34 35.56,34.61 35.56,33.34 34.29,33.34 34.29,34.61 33.02,35.88 33.02,34.61 33.02,33.34 30.48,30.8 30.48,29.53 29.21,30.8 29.21,29.53 34.29,32.07 34.29,30.8 34.29,29.53 33.02,32.07 33.02,30.8 33.02,29.53 31.75,29.53 31.75,30.8 31.75,32.07 34.29,28.26 34.29,26.99 34.29,25.72 33.02,28.26 33.02,26.99 33.02,25.72 31.75,25.72 31.75,28.26 38.1,28.26 38.1,26.99 38.1,25.72 36.83,28.26 36.83,26.99 36.83,25.72 35.56,25.72 35.56,26.99 35.56,28.26 38.1,24.45 38.1,23.18 36.83,24.45 36.83,23.18 35.56,23.18 30.48,28.26 30.48,25.72 29.21,28.26 29.21,26.99 29.21,25.72 30.48,24.45 30.48,23.18 29.21,24.45 29.21,23.18 34.29,24.45 34.29,23.18 33.02,24.45 33.02,23.18 31.75,23.18 35.56,35.88 34.29,35.88 31.75,35.88 31.75,34.61 31.75,33.34
  pour Top: 41.91,37.15 28.57,37.15 28.57,21.91 39.37,21.91 39.37,32.07 41.91,32.07
  pour Bottom: 41.91,37.15 28.57,37.15 28.57,21.91 39.37,21.91 39.37,32.07 41.91,32.07
N$2
  Top 0.508: U$1.VIN+1 U$1.VIN+2
  Top 0.61: U$1.VIN+1 30.92,42.86 20.59,42.86 U$16.P$1 15.5,37.77 15.5,25.92 15.24,25.66 15.24,15.56 16.51,14.29 X2.9
N$3
  Top 0.152: R2.2 6.71,8.76 X2.14
N$4
  Top 0.152: R1.2 12.41,28.6 10.79,26.99 9.53,26.99 8.26,25.72 8.26,23.18 7.89,22.82 X2.12
N$5
  Top 0.305: U5.4 73.02,15.56 72.39,16.19 72.39,18.1 R6.2
N$6
  Top 0.152: R5.2 7.39,33.97 J6.3
N$10
  Top 0.152: D5.C 60.11,8.14 R23.2
N$11
  Top 0.152: Y4.3 51.17,3.52 IC2.16
N$12
  Top 0.152: IC2.17 51.82,4.39 51.82,4.05 52.37,3.49 54.61,3.49 55.25,2.86 55.25,1.85 Y4.1
N$13
  Top 0.152: J6.2 8.83,34.62 R4.2
N$14
  Top 0.305: R24.2 73.66,32.7 U1.4
N$18  (via drill 0.35)
  Top 0.152: C21.1 22.13,9.25 v22.3,9.42 | v27.4,6.83 30.92,6.83 U4.20
  Bottom 0.152: v27.4,6.83 25.92,8.31 23.65,8.31 22.54,9.42 v22.3,9.42
N$19
  Top 0.152: U4.22 31.53,6.02 23.05,6.02 22.72,5.69 20.81,5.69 C22.1
N$20  (via drill 0.35)
  Top 0.152: R12.2 25.77,7.48 v26.93,8.64 | U4.10 30.43,13.58 v31.31,12.7
  Bottom 0.152: v31.31,12.7 26.93,12.7 25.81,11.58 25.81,11.5 25.81,9.76 v26.93,8.64
N$23
  Top 0.152: C40.1 24.02,10.18 23.42,10.78 23.39,10.78 23.25,10.91 23.25,12.76 R21.1 R22.1
N$25  (via drill 0.35)
  Top 0.152: 25MHZ.3 38.65,4.15 C35.1 37.55,4.05 v37.02,4.06 | v35.85,10.22 36.73,10.22 U4.31
  Bottom 0.152: v37.02,4.06 35.85,5.29 v35.85,10.22
N$26  (via drill 0.35)
  Top 0.152: C36.1 43.01,1.8 25MHZ.1 41.19,1.8 40.36,0.97 37.72,0.97 37.7,0.95 36.87,0.95 v36.79,1.02 | v36.53,9.46 36.79,9.46 U4.30
  Bottom 0.152: v36.79,1.02 36.79,3 37.63,3.83 37.63,4.28 36.87,5.04 36.87,9.12 v36.53,9.46
OUT1
  Top 1.27: U1.6 85.09,33.97 85.72,33.34 85.72,29.53 86.79,28.46 X1.2
OUT2
  Top 1.27: U1.8 86.99,36.51 88.27,35.24 X1.1
OUT3
  Top 1.27: X3.1 84.98,19.37 U5.8
OUT4
  Top 1.27: X3.2 84.02,16.83 U5.6
RD+  (via drill 0.35)
  Bottom 0.152: X2.1 19.68,23.23 18.75,22.29 18.75,15.26 17.78,14.29 16.51,14.29 15.88,13.65 15.88,12.38 16.51,11.75 23.79,11.75 C38.2
  other vias: 24.03,11.51
RD-
  Top 0.152: X2.2 15.88,21.91 15.88,17.46 16.51,16.83 17.78,16.83 19.05,15.56 | C39.2 23.04,17.64 20.95,15.56 19.05,15.56 | 19.05,15.56
RDN
  Top 0.152: R22.2 28.99,15.59 29.84,16.45 31.21,16.45 U4.5
  Top 0.2: R22.2 C39.1
RDP
  Top 0.152: R21.2 27.58,13.55 30.02,15.99 30.97,15.99 U4.6
  Top 0.2: R21.2 25.74,11.54 C38.1
RST
  Top 0.152: IC2.13 49.67,2.98 SW1.4 SW1.2 45.24,2.39 43.18,0.33 19.04,0.33 J7.5
SCK  (via drill 0.35)
  Top 0.152: IC2.9 42.38,6.51 42.14,6.76 41.61,6.76 U4.33 37.25,11.11 v36.83,11.11
  Bottom 0.152: v36.83,11.11 36.49,10.77 35.62,10.77 26.43,1.59 15.24,1.59 J7.3
SCSN_WIZ
  Top 0.152: U4.32 41.49,6.17 R7.2 42.32,6.03 43.51,4.84 48.37,4.84 48.83,5.3 48.83,6.73 48.69,6.87 48.34,6.87 IC2.8
TDN  (via drill 0.35)
  Top 0.152: 33.16,17.33 U4.1 32.57,17.92 v29.81,17.92 | v24.53,20.67 24.03,21.18 R20.1 20.4,18.1 X2.6
  Bottom 0.152: v24.53,20.67 25.01,20.67 26.66,19.02 28.7,19.02 v29.81,17.92
TDP  (via drill 0.35)
  Top 0.152: X2.5 19.68,19.42 v23.98,23.71 R19.1 | U4.2 32.48,17.31 v31.64,17.31
  Bottom 0.152: v31.64,17.31 28.84,20.1 28.09,20.1 27.83,20.36 27.21,20.36 23.98,23.6 v23.98,23.71
VBAT  (via drill 0.35, 1)
  Top 0.152: C13.1 C15.1
  Top 0.305: C15.1 R13.2
  Top 0.813: U1.5 80.98,31.97 v80.54,31.53 C4.1 80.76,28.57 C14.+ | C18.+ 78.32,10.38 C17.1 v79.16,13.86 80.34,15.04 U5.5
  Top 1.27: U$16.P$8 61.62,33.75 C5.+ 62.04,26.99 59.69,26.99 56.77,24.07 U6.3
  Bottom 1.27: U$16.P$8 54.88,31.43 v51.61,31.43
  other vias: 46.53,31.43 47.8,31.43 49.07,31.43 50.34,31.43 52.88,30.16 51.61,30.16 50.34,30.16 49.07,30.16 47.8,30.16 46.53,30.16 46.53,28.89 47.8,28.89 49.07,28.89 50.34,28.89 51.61,28.89 52.88,28.89 46.53,27.62 45.26,27.62 43.99,27.62 43.99,26.35 43.99,25.08 43.99,23.81 43.99,22.54 43.99,21.27 43.99,20 45.26,20 46.53,20 47.8,20 49.07,20 50.34,20 51.61,20 52.88,20 52.88,21.27 51.61,21.27 50.34,21.27 49.07,21.27 47.8,21.27 46.53,21.27 45.26,21.27 45.26,22.54 45.26,23.81 45.26,25.08 45.26,26.35 46.53,26.35 46.53,25.08 46.53,23.81 46.53,22.54 47.8,22.54 49.07,22.54 50.34,22.54 51.61,22.54 52.88,22.54 52.88,23.81 51.61,23.81 50.34,23.81 49.07,23.81 47.8,23.81 47.8,25.08 49.07,25.08 50.34,25.08 51.61,25.08 52.88,25.08 52.88,26.35 51.61,26.35 50.34,26.35 49.07,26.35 47.8,26.35 47.8,27.62 49.07,27.62 50.34,27.62 51.61,27.62 52.88,27.62 64.55,5.4 64.55,3.49 62.87,3.49
  pour Bottom: 45.72,32.07 53.98,32.07 53.98,19.37 43.18,19.37 43.18,28.26 45.72,28.26
  pour Top: 45.72,32.07 53.98,32.07 53.98,19.37 43.18,19.37 43.18,28.26 45.72,28.26
  pour Bottom (rank 2): 42.55,50.48 42.55,-3.49 100.96,-3.49 100.96,50.48
VBUS  (via drill 0.35)
  Top 0.152: v45.72,13.02 45.09,13.65 45.09,16.19 42.55,18.73 42.55,28.26 43.18,28.89 44.45,28.89 45.09,29.53 45.09,37.78 43.82,39.05 v30.48,39.05 | 65.15,14.67 T1.1 | J6.1 10.83,35.27 v15.24,39.69
  Top 0.203: IC2.7 48.08,7.39 47.69,7.39 47.6,7.3 v46.36,7.3
  Top 0.254: T1.1 65.13,14.92 v62.87,14.92
  Bottom 0.152: v45.72,13.02 46.36,12.38 v46.36,7.3 | v15.24,39.69 29.84,39.69 v30.48,39.05
  Bottom 0.254: v62.87,14.92 60.96,13.02 v45.72,13.02
VCCA  (via drill 0.35)
  Top 0.152: v28.2,10.09 30.23,12.12 30.25,12.12 30.59,12.46 30.59,12.65 30.08,13.16 U4.11 30.08,13.51 29.57,14.02 29.57,14.63 v30.3,15.37 30.3,15.23 U4.8 | v28.87,8.86 29.43,8.86 U4.15 30.61,9.87 31.12,10.38 31.31,10.38 31.65,10.04 31.65,10.02 31.71,9.96 31.71,9.73 31.26,9.29 | R19.2 25.77,23.76 | C37.1 25.84,19.58 v26.89,19.58 26.89,19.16 v29.26,16.79 31.37,16.79 31.4,16.75 31.62,16.75 U4.4 | 31.26,9.29 U4.17 31.31,9.16 31.44,9.29 | U4.21 33.08,8.27 33.08,8.62 32.02,9.68 31.82,9.68 31.44,9.29 | 31.44,9.29 31.26,9.29
  Top 0.2: R19.2 25.77,23.76 | C37.1 R20.2 25.73,23.74 25.72,23.74 R19.2 C9.1 C10.1 25.73,27.86 C25.1 25.75,29.91 L2.2
  Bottom 0.152: v28.2,10.09 28.2,9.53 v28.87,8.86 | v29.26,16.79 29.26,16.41 v30.3,15.37
WIZ_RST_WIZ
  Top 0.152: U4.37 39.97,12.98 40.64,13.65 R8.1

### Text on the board
tPlace: MotorDriver / Rev-A | 1 | 2
Document: + | + | + | + | + | +
tDocu: A5 | A4 | A3 | A2 | A1 | A0 | 9 | 10 | 11 | 12 | 13 | 0 | 1 | 2 | 3 | 4 | 5 | 6 | 7 | 8